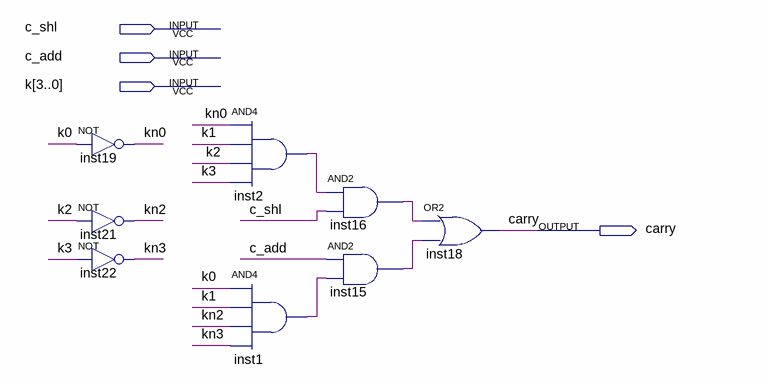
[diagram p0: schematic sheet]
// Quartus schematic carry_check_ahmes.bdf as structural Verilog: 8 symbols, 4 pins
module carry_check_ahmes (
  input  c_shl,
  input  c_add,
  input  [3:0] k,
  output carry
);

  wire inst1_out, inst2_out, inst15_out, inst16_out, kn0, kn2, kn3;

  not inst19 (kn0, k[0]);
  not inst21 (kn2, k[2]);
  not inst22 (kn3, k[3]);
  and inst2 (inst2_out, kn0, k[1], k[2], k[3]);
  and inst1 (inst1_out, k[0], k[1], kn2, kn3);
  and inst16 (inst16_out, inst2_out, c_shl);
  and inst15 (inst15_out, c_add, inst1_out);
  or inst18 (carry, inst16_out, inst15_out);
endmodule
